# Altium schematic sheet Sheet2.SchDoc
size A4
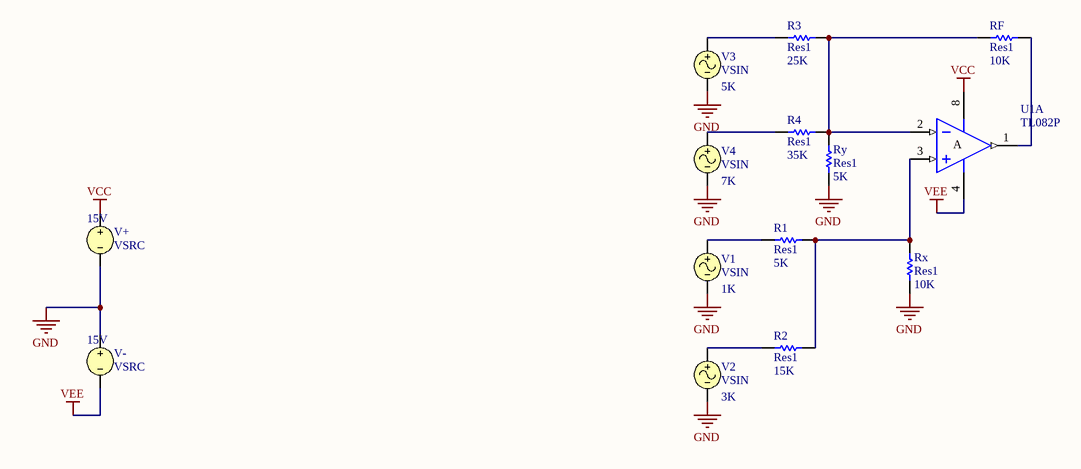
[diagram p0: Sheet2.SchDoc]

## Parts
R1  Res1  value 5K  [AXIAL-0.3]
R2  Res1  value 15K  [AXIAL-0.3]
R3  Res1  value 25K  [AXIAL-0.3]
R4  Res1  value 35K  [AXIAL-0.3]
RF  Res1  value 10K  [AXIAL-0.3]
Rx  Res1  value 10K  [AXIAL-0.3]
Ry  Res1  value 5K  [AXIAL-0.3]
U1  TL082P  [P008]  (part A of 2)
V1  VSIN  Frequency: 1K
V2  VSIN  Frequency: 3K
V3  VSIN  Frequency: 5K
V4  VSIN  Frequency: 7K
V+  VSRC  value 15V
V-  VSRC  value 15V

## Nets
GND: Rx.1 Ry.1 V1.2 V2.2 V3.2 V4.2 V+.2 V-.1
VCC: U1.8(V+) V+.1
VEE: U1.4(V-) V-.2
NetR1_1: R1.1 V1.1
NetR1_2: R1.2 R2.2 Rx.2 U1.3(IN+)
NetR2_1: R2.1 V2.1
NetR3_1: R3.1 V3.1
NetR3_2: R3.2 R4.2 RF.1 Ry.2 U1.2(IN-)
NetR4_1: R4.1 V4.1
NetRF_2: RF.2 U1.1(OUT)

## Notes on the sheet
- (in symbol TL082P, part A) A

## Library data of the parts
R1-R4 RF Rx Ry = Res1: Resistor; Published: 8-Jun-2000; LatestRevisionDate: 17-Jul-2002; LatestRevisionNote: Re-released for DXP Platform.; PackageReference: AXIAL-0.3; Publisher: Altium Limited; PackageDescription: Axial Device, Thru-Hole; 2 Leads; 0.3 in Pin Spacing
U1 = TL082P: JFET-Input Operational Amplifier; Published: 16-Jan-2001; LatestRevisionDate: 04-Mar-2005; LatestRevisionNote: Stylized 3D Model Added.; DatasheetVersion: Feb-1999; PackageVersion: Jun-1999; PackageReference: P008; Publisher: Altium Limited; PackageDescription: DIP; 8 Leads; Row Spacing 7.62 mm; Pitch 2.54 mm; Code_JEDEC: MO-001-AN; ComponentLink1Description: Manufacturer Link; ComponentLink1URL: http://www.ti.com/; ComponentLink2Description: Datasheet; ComponentLink2URL: http://www-s.ti.com/sc/ds/tl082.pdf
V1-V4 = VSIN: Sinusoidal Voltage Source; Note: PCB Footprint - Not required; Published: 8-Jun-2000; LatestRevisionDate: 15-Nov-2004; LatestRevisionNote: Corrected Netlist.; PackageReference: Not Applicable; Publisher: Altium Limited
V+ V- = VSRC: Voltage Source; Note: PCB Footprint - Not required; Published: 8-Jun-2000; LatestRevisionDate: 17-Jul-2002; LatestRevisionNote: Re-released for DXP Platform.; PackageReference: Not Applicable; Publisher: Altium Limited